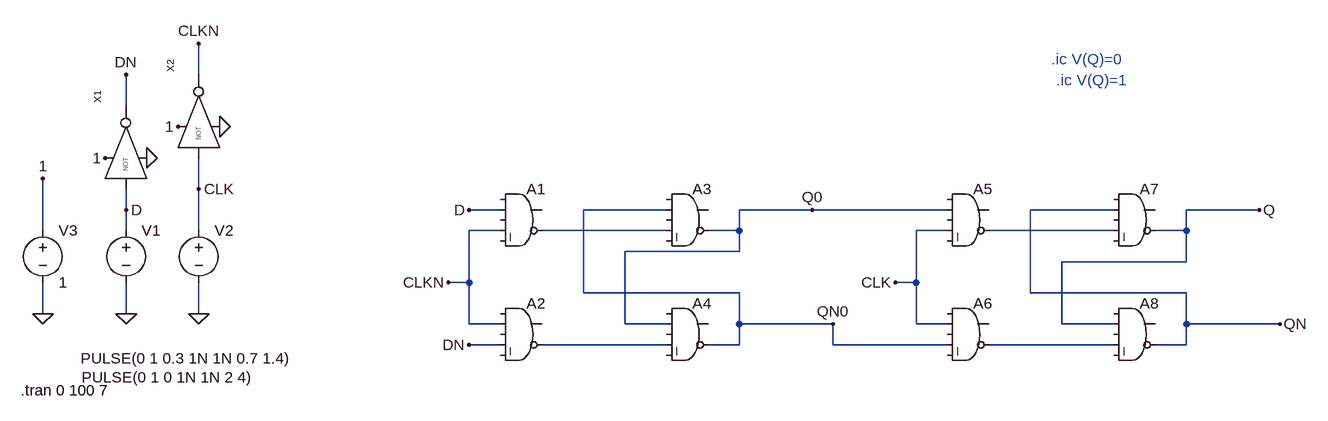
[diagram p0: schematic Draft48.asc]
Draft48.asc, the LTspice schematic file:
Version 4
SHEET 1 1556 1180
WIRE -384 -144 -384 -192
WIRE -496 -96 -496 -144
WIRE -384 32 -384 -16
WIRE -496 64 -496 32
WIRE 80 64 32 64
WIRE 336 64 208 64
WIRE 560 64 448 64
WIRE 768 64 560 64
WIRE 1024 64 896 64
WIRE 1248 64 1136 64
WIRE -624 96 -624 16
WIRE -496 96 -496 64
WIRE -384 96 -384 32
WIRE 80 96 32 96
WIRE 336 96 144 96
WIRE 448 96 448 64
WIRE 448 96 400 96
WIRE 768 96 720 96
WIRE 1024 96 832 96
WIRE 1136 96 1136 64
WIRE 1136 96 1088 96
WIRE 448 128 448 96
WIRE 448 128 272 128
WIRE 1136 144 1136 96
WIRE 1136 144 944 144
WIRE 32 176 32 96
WIRE 32 176 0 176
WIRE 720 176 720 96
WIRE 720 176 688 176
WIRE 208 192 208 64
WIRE 448 192 208 192
WIRE 896 192 896 64
WIRE 1136 192 896 192
WIRE -624 224 -624 176
WIRE -496 224 -496 176
WIRE -384 224 -384 176
WIRE 32 240 32 176
WIRE 80 240 32 240
WIRE 272 240 272 128
WIRE 336 240 272 240
WIRE 448 240 448 192
WIRE 592 240 448 240
WIRE 720 240 720 176
WIRE 768 240 720 240
WIRE 944 240 944 144
WIRE 1024 240 944 240
WIRE 1136 240 1136 192
WIRE 1280 240 1136 240
WIRE 80 272 32 272
WIRE 336 272 144 272
WIRE 448 272 448 240
WIRE 448 272 400 272
WIRE 592 272 592 240
WIRE 768 272 592 272
WIRE 1024 272 832 272
WIRE 1136 272 1136 240
WIRE 1136 272 1088 272
FLAG 560 64 Q0
FLAG 592 240 QN0
FLAG 32 64 D
FLAG 0 176 CLKN
FLAG 32 272 DN
FLAG -528 -16 1
FLAG -624 16 1
FLAG -464 -16 0
FLAG -624 224 0
FLAG -496 224 0
FLAG -384 224 0
FLAG -496 64 D
FLAG -496 -144 DN
FLAG -384 32 CLK
FLAG 1248 64 Q
FLAG 1280 240 QN
FLAG 688 176 CLK
FLAG -416 -64 1
FLAG -352 -64 0
FLAG -384 -192 CLKN
SYMBOL Digital\\and 112 16 R0
SYMATTR InstName A1
SYMBOL Digital\\and 112 192 R0
SYMATTR InstName A2
SYMBOL Digital\\and 368 16 R0
SYMATTR InstName A3
SYMBOL Digital\\and 368 192 R0
SYMATTR InstName A4
SYMBOL voltage -496 80 R0
WINDOW 3 -70 213 Left 2
WINDOW 123 0 0 Left 0
WINDOW 39 0 0 Left 0
SYMATTR InstName V1
SYMATTR Value PULSE(0 1 0.3 1N 1N 0.7 1.4)
SYMBOL voltage -384 80 R0
WINDOW 3 -180 242 Left 2
WINDOW 123 0 0 Left 0
WINDOW 39 0 0 Left 0
SYMATTR InstName V2
SYMATTR Value PULSE(0 1 0 1N 1N 2 4)
SYMBOL NOT4 -480 -32 R270
SYMATTR InstName X1
SYMBOL voltage -624 80 R0
WINDOW 123 0 0 Left 0
WINDOW 39 0 0 Left 0
SYMATTR InstName V3
SYMATTR Value 1
SYMBOL Digital\\and 800 16 R0
SYMATTR InstName A5
SYMBOL Digital\\and 800 192 R0
SYMATTR InstName A6
SYMBOL Digital\\and 1056 16 R0
SYMATTR InstName A7
SYMBOL Digital\\and 1056 192 R0
SYMATTR InstName A8
SYMBOL NOT4 -368 -80 R270
SYMATTR InstName X2
TEXT -658 342 Left 2 !.tran 0 100 7
TEXT 928 -168 Left 2 ;.ic V(Q)=0
TEXT 936 -136 Left 2 ;.ic V(Q)=1

The netlist it stands for:
* Draft48.asc
A1 0 D 0 CLKN 0 N001 0 0 AND
A2 0 CLKN 0 DN 0 N003 0 0 AND
A3 0 QN0 0 N001 0 Q0 0 0 AND
A4 0 Q0 0 N003 0 QN0 0 0 AND
V1 D 0 PULSE(0 1 0.3 1N 1N 0.7 1.4)
V2 CLK 0 PULSE(0 1 0 1N 1N 2 4)
XX1 D 1 0 DN NOT4  ; pins A VH VL OUT
V3 1 0 1
A5 0 Q0 0 CLK 0 N002 0 0 AND
A6 0 CLK 0 QN0 0 N004 0 0 AND
A7 0 QN 0 N002 0 Q 0 0 AND
A8 0 Q 0 N004 0 QN 0 0 AND
XX2 CLK 1 0 CLKN NOT4  ; pins A VH VL OUT
.tran 0 100 7
* .ic V(Q)=0
* .ic V(Q)=1
.backanno
.end

* Results of the author's LTspice run, read from the files saved beside the schematic
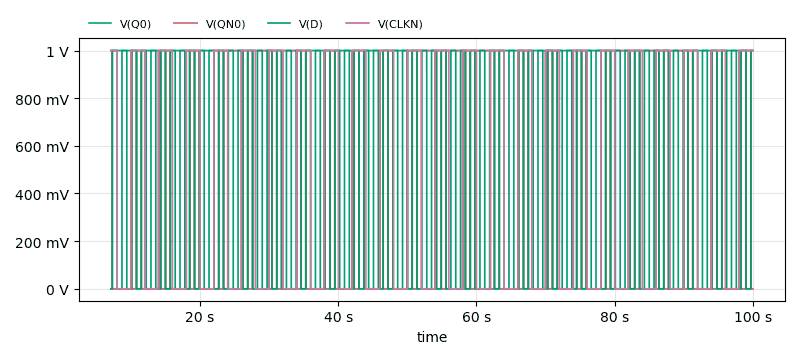
[diagram p1: Transient Analysis of Draft48.asc, plotted from the saved traces]
* Transient Analysis, 1 run:
*   V(Q0): min 0 V, max 1 V, average 558.6 mV, rms 747.4 mV, last 1 V
*   V(QN0): min 0 V, max 1 V, average 441.4 mV, rms 664.4 mV, last 0 V
*   V(D): min 0 V, max 1 V, average 500.5 mV, rms 707.4 mV, last 1 V
*   V(CLKN): min -888.7 nV, max 1.001 V, average 504.9 mV, rms 710.6 mV, last 1 V